# EAGLE design Node (EAGLE 9.6.2)
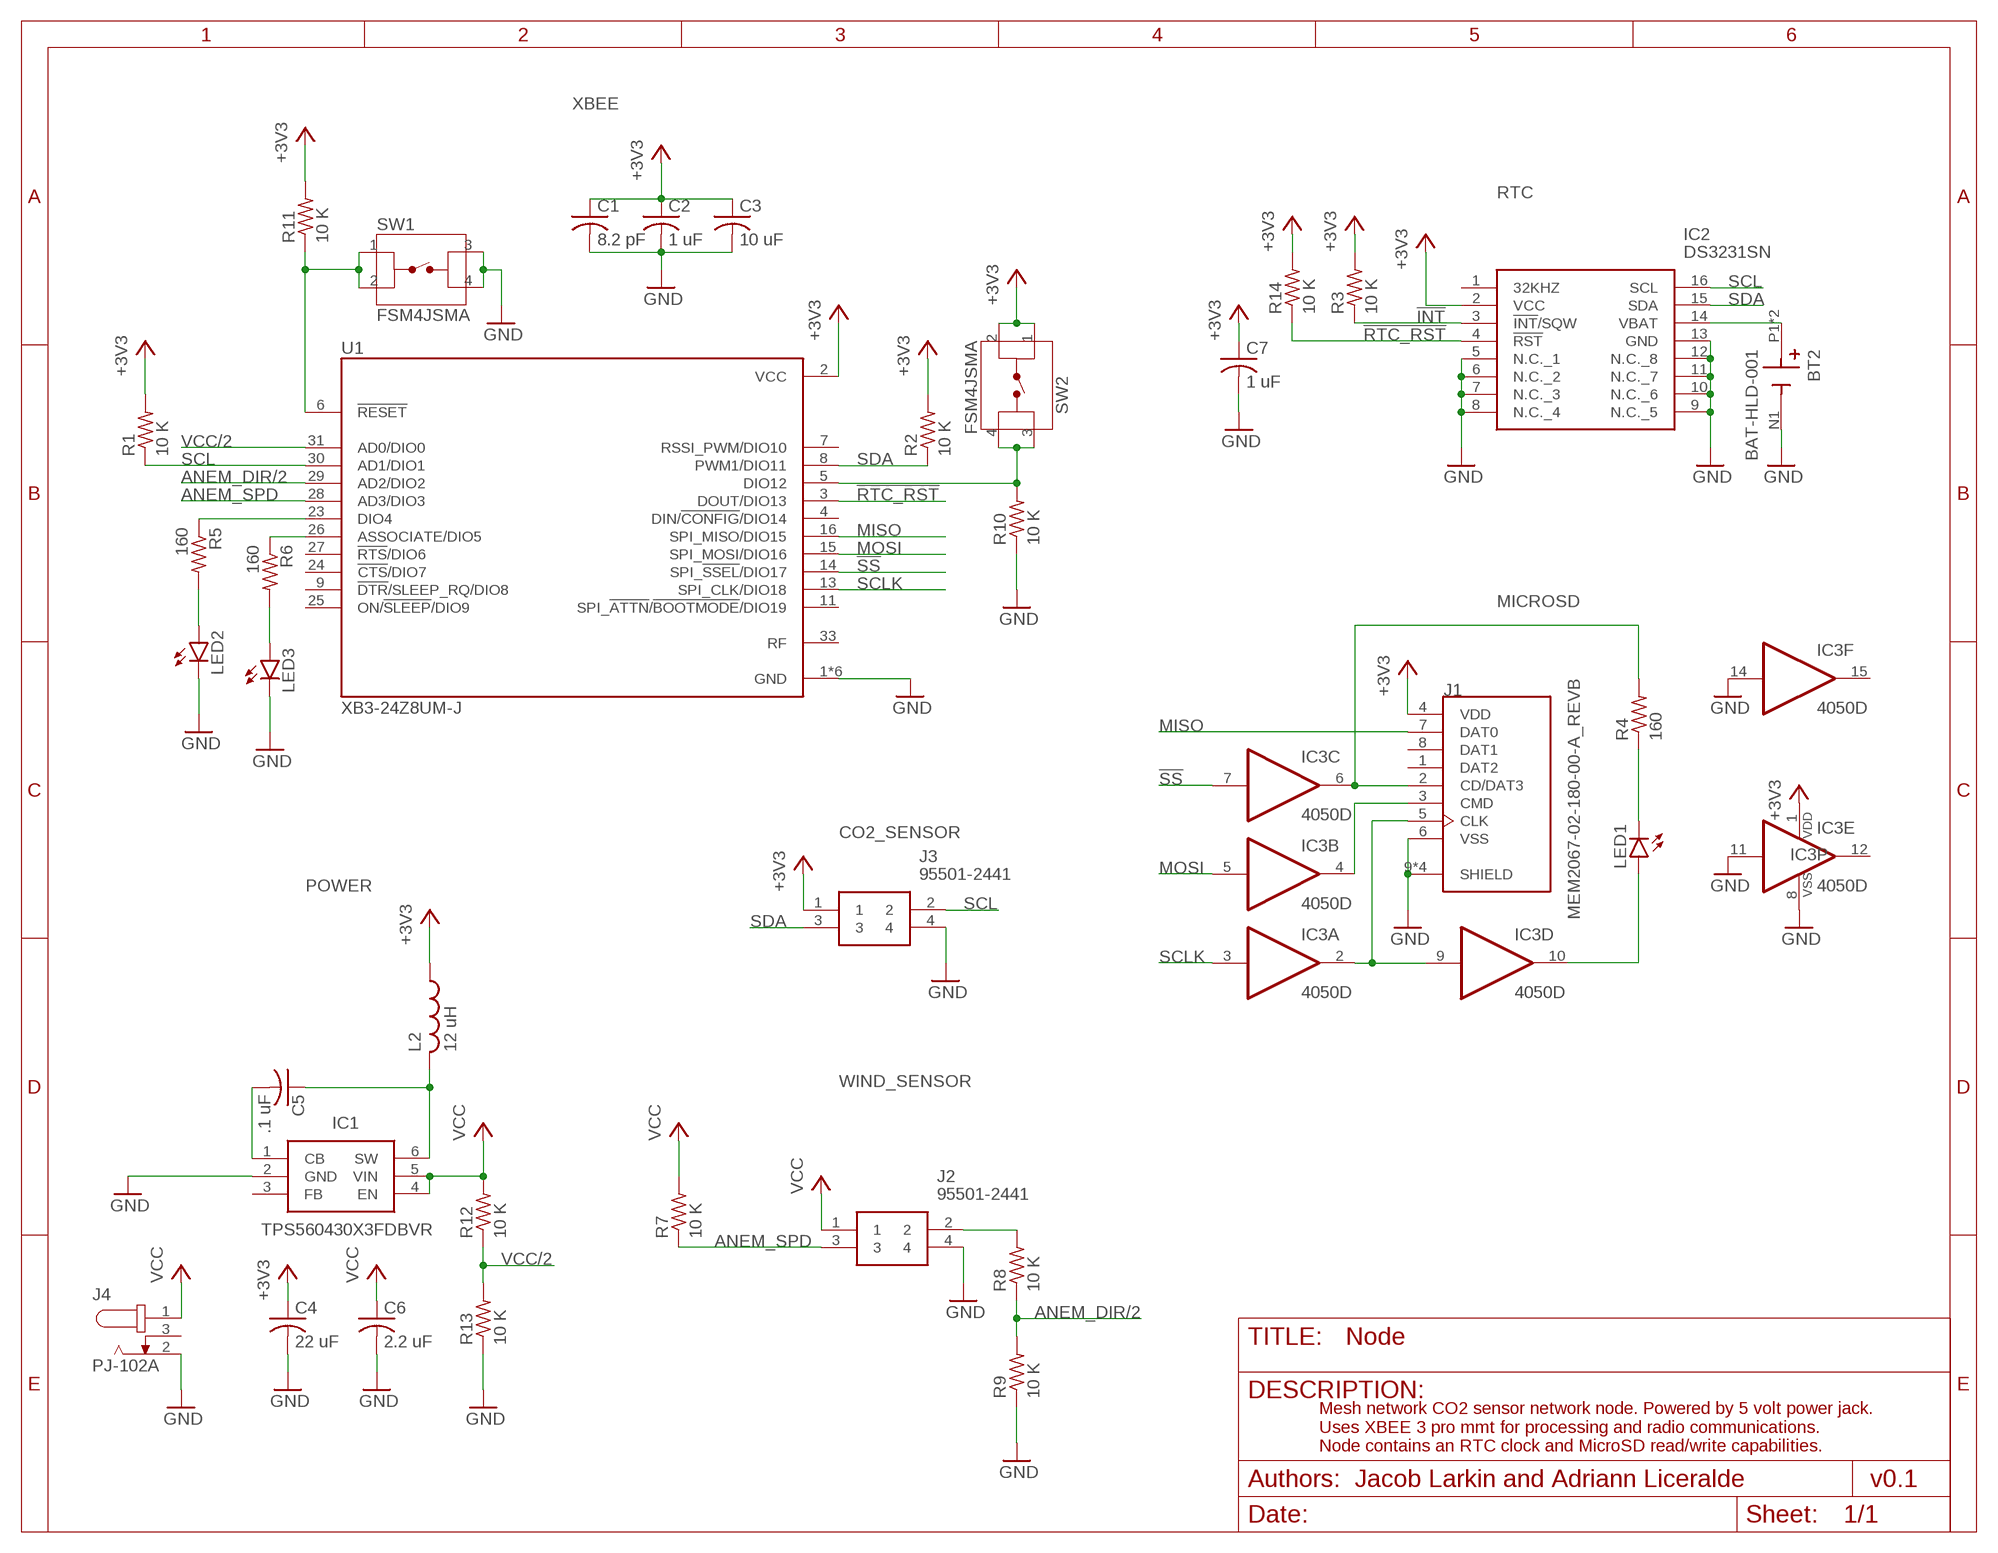
[diagram p0: schematic, sheet 1]

## Parts
BT2  BAT-HLD-001  [BAT_BAT-HLD-001]
C1  8.2 pF  C-USC0805  [C0805]
C2  1 uF  C-USC0805  [C0805]
C3  10 uF  C-USC0805  [C0805]
C4  22 uF  C-USC0805  [C0805]
C5  .1 uF  C-USC0805  [C0805]
C6  2.2 uF  C-USC0805  [C0805]
C7  1 uF  C-USC0805  [C0805]
IC1  TPS560430X3FDBVR  [SOT95P280X145-6N]
IC2  DS3231SN  [SOIC127P1032X265-16N]
IC3  4050D  [SO16]
J1  MEM2067-02-180-00-A_REVB  [GCT_MEM2067-02-180-00-A_REVB]
J2  95501-2441  [955012441]
J3  95501-2441  [955012441]
J4  PJ-102A  [CUI_PJ-102A]
L2  12 uH  L-USL1812  [L1812]
LED1  LEDCHIP-LED0805  [CHIP-LED0805]
LED2  LEDCHIP-LED0805  [CHIP-LED0805]
LED3  LEDCHIP-LED0805  [CHIP-LED0805]
R1  10 K  R-US_R0805  [R0805]
R2  10 K  R-US_R0805  [R0805]
R3  10 K  R-US_R0805  [R0805]
R4  160  R-US_R0805  [R0805]
R5  160  R-US_R0805  [R0805]
R6  160  R-US_R0805  [R0805]
R7  10 K  R-US_R0805  [R0805]
R8  10 K  R-US_R0805  [R0805]
R9  10 K  R-US_R0805  [R0805]
R10  10 K  R-US_R0805  [R0805]
R11  10 K  R-US_R0805  [R0805]
R12  10 K  R-US_R0805  [R0805]
R13  10 K  R-US_R0805  [R0805]
R14  10 K  R-US_R0805  [R0805]
SW1  FSM4JSMA  [FSM4JSMA]
SW2  FSM4JSMA  [FSM4JSMA]
U1  XB3-24Z8UM-J  [XCVR_XB3-24Z8UM-J]

## Nets
!INT: IC2.3(!INT!/SQW) R3.1
!RTC_RST: IC2.4(!RST) R14.1 U1.3(DOUT/DIO13)
!SS: IC3.7(C:I) U1.14(SPI_!SSEL!/DIO17)
+3V3: C1.1 C2.1 C3.1 C4.1 C7.1 IC2.2(VCC) IC3.1(P:VDD) J1.4(VDD) J3.1 L2.1 R1.2 R2.2 R3.2 R11.2 R14.2 SW2.1 SW2.2 U1.2(VCC)
ANEM_DIR: J2.2 R8.2
ANEM_DIR/2: R8.1 R9.2 U1.29(AD2/DIO2)
ANEM_SPD: J2.3 R7.1 U1.28(AD3/DIO3)
GND: BT2.N1(-) C1.2 C2.2 C3.2 C4.2 C6.2 C7.2 IC1.2(GND) IC2.5(N.C._1) IC2.6(N.C._2) IC2.7(N.C._3) IC2.8(N.C._4) IC2.9(N.C._5) IC2.10(N.C._6) IC2.11(N.C._7) IC2.12(N.C._8) IC2.13(GND) IC3.8(P:VSS) IC3.11(E:I) IC3.14(F:I) J1.6(VSS) J1.9(SHIELD) J1.10(SHIELD) J1.11(SHIELD) J1.12(SHIELD) J2.4 J3.4 J4.2 LED2.C LED3.C R9.1 R10.1 R13.1 SW1.3 SW1.4 U1.1(GND) U1.10(GND) U1.12(GND) U1.21(GND) U1.32(GND) U1.34(GND)
MISO: J1.7(DAT0) U1.16(SPI_MISO/DIO15)
MOSI: IC3.5(B:I) U1.15(SPI_MOSI/DIO16)
N$1: LED2.A R5.2
N$2: IC3.4(B:O) J1.3(CMD)
N$3: C5.2 IC1.1(CB)
N$4: BT2.P1(+) BT2.P2(+) IC2.14(VBAT)
N$5: C5.1 IC1.6(SW) L2.2
N$6: IC3.6(C:O) J1.2(CD/DAT3) R4.2
N$8: LED3.A R6.2
N$9: IC3.10(D:O) LED1.A
N$10: LED1.C R4.1
N$11: IC3.2(A:O) IC3.9(D:I) J1.5(CLK)
N$12: R5.1 U1.23(DIO4)
N$13: R6.1 U1.26(ASSOCIATE/DIO5)
N$14: R11.1 SW1.1 SW1.2 U1.6(!RESET)
N$16: R10.2 SW2.3 SW2.4 U1.5(DIO12)
SCL: IC2.16(SCL) J3.2 R1.1 U1.30(AD1/DIO1)
SCLK: IC3.3(A:I) U1.13(SPI_CLK/DIO18)
SDA: IC2.15(SDA) J3.3 R2.1 U1.8(PWM1/DIO11)
VCC: C6.1 IC1.4(EN) IC1.5(VIN) J2.1 J4.1 R7.2 R12.2
VCC/2: R12.1 R13.2 U1.31(AD0/DIO0)
Unconnected: IC1.3(FB) IC2.1(32KHZ) IC3.12(E:O) IC3.15(F:O) J1.1(DAT2) J1.8(DAT1) J4.3 U1.4(DIN/!CONFIG!/DIO14) U1.7(RSSI_PWM/DIO10) U1.9(!DTR!/SLEEP_RQ/DIO8) U1.11(SPI_!ATTN!/!BOOTMODE!/DIO19) U1.24(!CTS!/DIO7) U1.25(ON/!SLEEP!/DIO9) U1.27(!RTS!/DIO6) U1.33(RF)

## Notes on the sheet
- XBEE
- RTC
- MICROSD
- CO2_SENSOR
- POWER
- WIND_SENSOR
- Mesh network CO2 sensor network node. Powered by 5 volt power jack.
  Uses XBEE 3 pro mmt for processing and radio communications.
  Node contains an RTC clock and MicroSD read/write capabilities.
- Jacob Larkin and Adriann Liceralde | v0.1

## Library data of the parts
BT2 = BAT-HLD-001:BAT-HLD-001: Battery Retainer Coin, 20.0mm 1 Cell SMD (SMT) Tab Check prices <https://pricing.snapeda.com/parts/BAT-HLD-001/Linx%20Technologies/view-part?ref=eda>; AVAILABILITY: Warning; DATASHEET: https://www.mouser.com/datasheet/2/238/bat_hld_001-1659379.pdf; DESCRIPTION: Holder for CR2032 and CR2025 Batteries, Surface-Mount, Bulk Packaging; MF: Linx Technologies; MOUSER_NUM: 712-BAT-HLD-001; MP: BAT-HLD-001; PACKAGE: NON-STANDARD-1 Linx Technologies; PRICE: .29; PRICE_25: .266; PURCHASE-URL: https://pricing.snapeda.com/search/part/BAT-HLD-001/?ref=eda
C1 = rcl:C-US: CAPACITOR, American symbol; DATASHEET: https://www.mouser.com/datasheet/2/427/vjw1bcbascomseries-1762447.pdf; MOUSER_NUM: 77-VJ0805A8R2BXXPBC; PRICE: .14; PRICE_50: .1; SPICEPREFIX: C
C2 C7 = rcl:C-US: CAPACITOR, American symbol; DATASHEET: https://www.mouser.com/datasheet/2/585/MLCC-1837944.pdf; MOUSER_NUM: 187-CL21B105KBFNNNG; PRICE: .11; PRICE_100: .04; SPICEPREFIX: C
C3 = rcl:C-US: CAPACITOR, American symbol; DATASHEET: https://www.mouser.com/datasheet/2/585/MLCC-1837944.pdf; MOUSER_NUM: 187-CL21A106KOQNNNG; PRICE: .1; PRICE_10: .044; SPICEPREFIX: C
C4 = rcl:C-US: CAPACITOR, American symbol; DATASHEET: https://www.mouser.com/datasheet/2/585/MLCC-1837944.pdf; MOUSER_NUM: 187-CL21A226MPQNNNE; PRICE: .18; PRICE_100: .064; SPICEPREFIX: C
C5 = rcl:C-US: CAPACITOR, American symbol; DATASHEET: https://www.mouser.com/datasheet/2/585/MLCC-1837944.pdf; MOUSER_NUM: 187-CL21B104KBCNNNC; PRICE: .1; PRICE_10: .027; SPICEPREFIX: C
C6 = rcl:C-US: CAPACITOR, American symbol; DATASHEET: https://www.mouser.com/datasheet/2/585/MLCC-1837944.pdf; MOUSER_NUM: 187-CL21A225KAFNNNE; PRICE: .1; PRICE_10: .053; SPICEPREFIX: C
IC1 = SamacSys_Parts:TPS560430X3FDBVR: SIMPLE SWITCHER 36-V, 600-mA Buck Regulator With High-Efficiency Sleep Mode Source: Datasheet <http://www.ti.com/lit/gpn/tps560430>; DATASHEET: https://www.ti.com/lit/ds/symlink/tps560430.pdf?HQS=dis-mous-null-mousermode-dsf-pf-null-wwe&DCM=yes&ref_url=https%3A%2F%2Fwww.mouser.com%2F&distId=26; DESCRIPTION: SIMPLE SWITCHER 36-V, 600-mA Buck Regulator With High-Efficiency Sleep Mode; HEIGHT: 1.45mm; MANUFACTURER_NAME: Texas Instruments; MANUFACTURER_PART_NUMBER: TPS560430X3FDBVR; MOUSER_NUM: 595-TPS560430X3FDBVR; MOUSER_PART_NUMBER: 595-TPS560430X3FDBVR; MOUSER_PRICE-STOCK: https://www.mouser.co.uk/ProductDetail/Texas-Instruments/TPS560430X3FDBVR/?qs=y6ZabgHbY%252Bzg1UxrVv3WVw%3D%3D; PRICE: 1.19; PRICE_10: 1.01
IC2 = SamacSys_Parts:DS3231SN: Real Time Clock Serial Maxim DS3231SN Real Time Clock, Battery Backup, Calendar, Clock, I2C, 5.5 V, 16-Pin SOIC Source: Datasheet <https://datasheets.maximintegrated.com/en/ds/DS3231.pdf>; DATASHEET: https://www.mouser.com/datasheet/2/256/DS3231-1513891.pdf; DESCRIPTION: Real Time Clock Serial Maxim DS3231SN Real Time Clock, Battery Backup, Calendar, Clock, I2C, 5.5 V, 16-Pin SOIC; HEIGHT: 2.65mm; MANUFACTURER_NAME: Maxim Integrated; MANUFACTURER_PART_NUMBER: DS3231SN; MOUSER_NUM: 700-DS3231SN#T&R-; MOUSER_PART_NUMBER: 700-DS3231SN; MOUSER_PRICE-STOCK: https://www.mouser.co.uk/ProductDetail/Maxim-Integrated/DS3231SN/?qs=1eQvB6Dk1vhUlr8%2FOrV0Fw%3D%3D; PRICE: 8.82; PRICE_50: 7.37
IC3 = 40xx:4050: Hex non-inverting BUFFER; DATASHEET: https://www.mouser.com/datasheet/2/916/74HC4050-1598370.pdf; MOUSER_NUM: 771-74HC4050D-T; PRICE: .51; PRICE_100: 25.70
J1 = MEM2067-02-180-00-A_REVB:MEM2067-02-180-00-A_REVB: Micro SD Memory Card ConnectorSMT, Hinged, 1.80mm Profile Check prices <https://pricing.snapeda.com/parts/MEM2067-02-180-00-A/Global%20Connector%20Technology/view-part?ref=eda>; AVAILABILITY: Warning; DATASHEET: https://gct.co/files/specs/mem2067-spec.pdf; DESCRIPTION: 8 Position Card Connector microSD Surface Mount, Right Angle Gold; DIGI-KEY_NUM: 2073-MEM2067-02-180-00-ATR-ND; MF: Global Connector Technology; MP: MEM2067-02-180-00-A; PACKAGE: None; PRICE: 1.08; PRICE_50: .85; PURCHASE-URL: https://pricing.snapeda.com/search/part/MEM2067-02-180-00-A/?ref=eda
J2 J3 = SamacSys_Parts:95501-2441: 4/4 way r/a PCB thru hole data skt,1.5A Molex Cat3 4P4C Right Angle Cable Mount Unshielded RJ22 Modular Plug Connector Source: Datasheet <http://www.molex.com/webdocs/datasheets/pdf/en-us/0955012441_MODULAR_JACKS_PLUG.pdf>; DATASHEET: https://www.mouser.com/datasheet/2/276/1/0955012441_MODULAR_JACKS_PLUG-177497.pdf; DESCRIPTION: 4/4 way r/a PCB thru hole data skt,1.5A Molex Cat3 4P4C Right Angle Cable Mount Unshielded RJ22 Modular Plug Connector; HEIGHT: 11.5mm; MANUFACTURER_NAME: Molex; MANUFACTURER_PART_NUMBER: 95501-2441; MOUSER_NUM: 538-95501-2441; MOUSER_PART_NUMBER: 538-95501-2441; MOUSER_PRICE-STOCK: https://www.mouser.co.uk/ProductDetail/Molex/95501-2441/?qs=KUIzHt%2Fe91n%2F9dmgv%2FFrWA%3D%3D; PRICE: .86; PRICE_100: .57
J4 = PJ-102A:PJ-102A: 2.0 mm Center Pin, 2.5 A, Right Angle, Through Hole, Tapered Pins, Dc Power Jack Connector Check prices <https://pricing.snapeda.com/parts/PJ-102A/CUI%20Devices/view-part?ref=eda>; AVAILABILITY: Good; CUI_PURCHASE_URL: https://www.cuidevices.com/product/interconnect/connectors/dc-power-connectors/jacks/pj-102a?utm_source=snapeda.com&utm_medium=referral&utm_campaign=snapedaBOM; DATASHEET: https://www.mouser.com/datasheet/2/670/pj_102a-1778834.pdf; DESCRIPTION: 2.0 x 6.5 mm, 2.5 A, Horizontal, Through Hole, Tapered Pins, Dc Power Jack Connector; MF: CUI Devices; MOUSER_NUM: 490-PJ-102A; MP: PJ-102A; PACKAGE: None; PRICE: .64; PRICE_10: .479; PURCHASE-URL: https://pricing.snapeda.com/search/part/PJ-102A/?ref=eda
L2 = rcl:L-US: INDUCTOR, American symbol; DATASHEET: https://www.mouser.com/datasheet/2/54/cm-777730.pdf; MOUSER_NUM: 652-CM453232-120KL; PRICE: .27; PRICE_50: .182; SPICEPREFIX: L
LED1-LED3 = led:LED: LED OSRAM: - CHIPLED LG R971, LG N971, LY N971, LG Q971, LY Q971, LO R971, LY R971 LH N974, LH R974 LS Q976, LO Q976, LY Q976 LO Q996 - Hyper CHIPLED LW Q18S LB Q993, LB Q99A, LB R99A - SideLED LS A670, LO A670, LY A670, LG A670, LP A670 LB A673, LV A673, LT A673, LW A673 LH A674 LY A675 LS A676, LA A676, LO A676, LY A676, LW A676 LS A679, LY A679, LG A679 - Hyper Micro SIDELED® LS Y876, LA Y876, LO Y876, LY Y876 LT Y87S - SmartLED LW L88C, LW L88S LB L89C, LB L89S, LG L890 LS L89K, LO L89K, LY L89K LS L896, LA L896, LO L896, LY L896 - TOPLED LS T670, LO T670, LY T670, LG T670, LP T670 LSG T670, LSP T670, LSY T670, LOP T670, LYG T670 LG T671, LOG T671, LSG T671 LB T673, LV T673, LT T673, LW T673 LH T674 LS T676, LA T676, LO T676, LY T676, LB T676, LH T676, LSB T676, LW T676 LB T67C, LV T67C, LT T67C, LS T67K, LO T67K, LY T67K, LW E67C LS E67B, LA E67B, LO E67B, LY E67B, LB E67C, LV E67C, LT E67C LW T67C LS T679, LY T679, LG T679 LS T770, LO T770, LY T770, LG T770, LP T770 LB T773, LV T773, LT T773, LW T773 LH T774 LS E675, LA E675, LY E675, LS T675 LS T776, LA T776, LO T776, LY T776, LB T776 LHGB T686 LT T68C, LB T68C - Hyper Mini TOPLED® LB M676 - Mini TOPLED Santana® LG M470 LS M47K, LO M47K, LY M47K Source: http://www.osram.convergy.de LUXEON: - LUMILED® LXK2-PW12-R00, LXK2-PW12-S00, LXK2-PW14-U00, LXK2-PW14-V00 LXK2-PM12-R00, LXK2-PM12-S00, LXK2-PM14-U00 LXK2-PE12-Q00, LXK2-PE12-R00, LXK2-PE12-S00, LXK2-PE14-T00, LXK2-PE14-U00 LXK2-PB12-K00, LXK2-PB12-L00, LXK2-PB12-M00, LXK2-PB14-N00, LXK2-PB14-P00, LXK2-PB14-Q00 LXK2-PR12-L00, LXK2-PR12-M00, LXK2-PR14-Q00, LXK2-PR14-R00 LXK2-PD12-Q00, LXK2-PD12-R00, LXK2-PD12-S00 LXK2-PH12-R00, LXK2-PH12-S00 LXK2-PL12-P00, LXK2-PL12-Q00, LXK2-PL12-R00 Source: www.luxeon.com KINGBRIGHT: KA-3528ASYC Source: www.kingbright.com; DATASHEET: https://dammedia.osram.info/media/resource/hires/osram-dam-14795755/LG%20R971_EN.pdf; MOUSER_NUM: 720-LGR971-KN-1; PRICE: .25; PRICE_100: .058
R1-R3 R7-R14 = rcl:R-US_: RESISTOR, American symbol; DATASHEET: https://www.mouser.com/datasheet/2/219/RK73H-1825326.pdf; MOUSER_NUM: 660-RK73H2ATTD1002F; PRICE: .1; PRICE_1000: .006; SPICEPREFIX: R
R4-R6 = rcl:R-US_: RESISTOR, American symbol; DATASHEET: https://www.mouser.com/datasheet/2/219/RK73H-1825326.pdf; MOUSER_NUM: 660-RK73H2ATTD1600F; PRICE: .1; PRICE_100: .014; SPICEPREFIX: R
SW1 SW2 = Switch:FSM4JSMA: SWITCH TACTILE SPST-NO 0.05A 24V Manufacturer's datasheet <https://www.te.com/commerce/DocumentDelivery/DDEController?Action=srchrtrv&DocNm=2-1437565-7&DocType=Customer+Drawing&DocLang=English>; CREATED_BY: PCBLayout.com; DATASHEET: https://www.mouser.com/datasheet/2/418/1/NG_CD_2-1437565-7_V-202667.pdf; DIGIKEY_PART_NUMBER: 450-1129-ND; MANUFACTURER: TE Connectivity ALCOSWITCH Switches; MOUSER_NUM: 506-FSM4JSMA; MPN: FSM4JSMA; PRICE: .24; PRICE_100: .197
U1 = XB3-24Z8UM-J:XB3-24Z8UM-J: XBee3, 2.4 GHz ZB 3.0, U.FL Ant, MMT Check prices <https://pricing.snapeda.com/parts/XB3-24Z8UM-J/Digi%20International/view-part?ref=eda>; AVAILABILITY: Good; DATASHEET: https://www.mouser.com/datasheet/2/111/ds_xbee-3-zigbee-3-1288823.pdf; DESCRIPTION: 802.15.4 Zigbee® Transceiver Module 2.4GHz Antenna Not Included, U.FL Surface Mount; MF: Digi International; MOUSER_NUM: 888-XB3-24Z8UM; MP: XB3-24Z8UM-J; PACKAGE: SMD-34 Digi International; PRICE: 18.99; PURCHASE-URL: https://pricing.snapeda.com/search/part/XB3-24Z8UM-J/?ref=eda

## Board
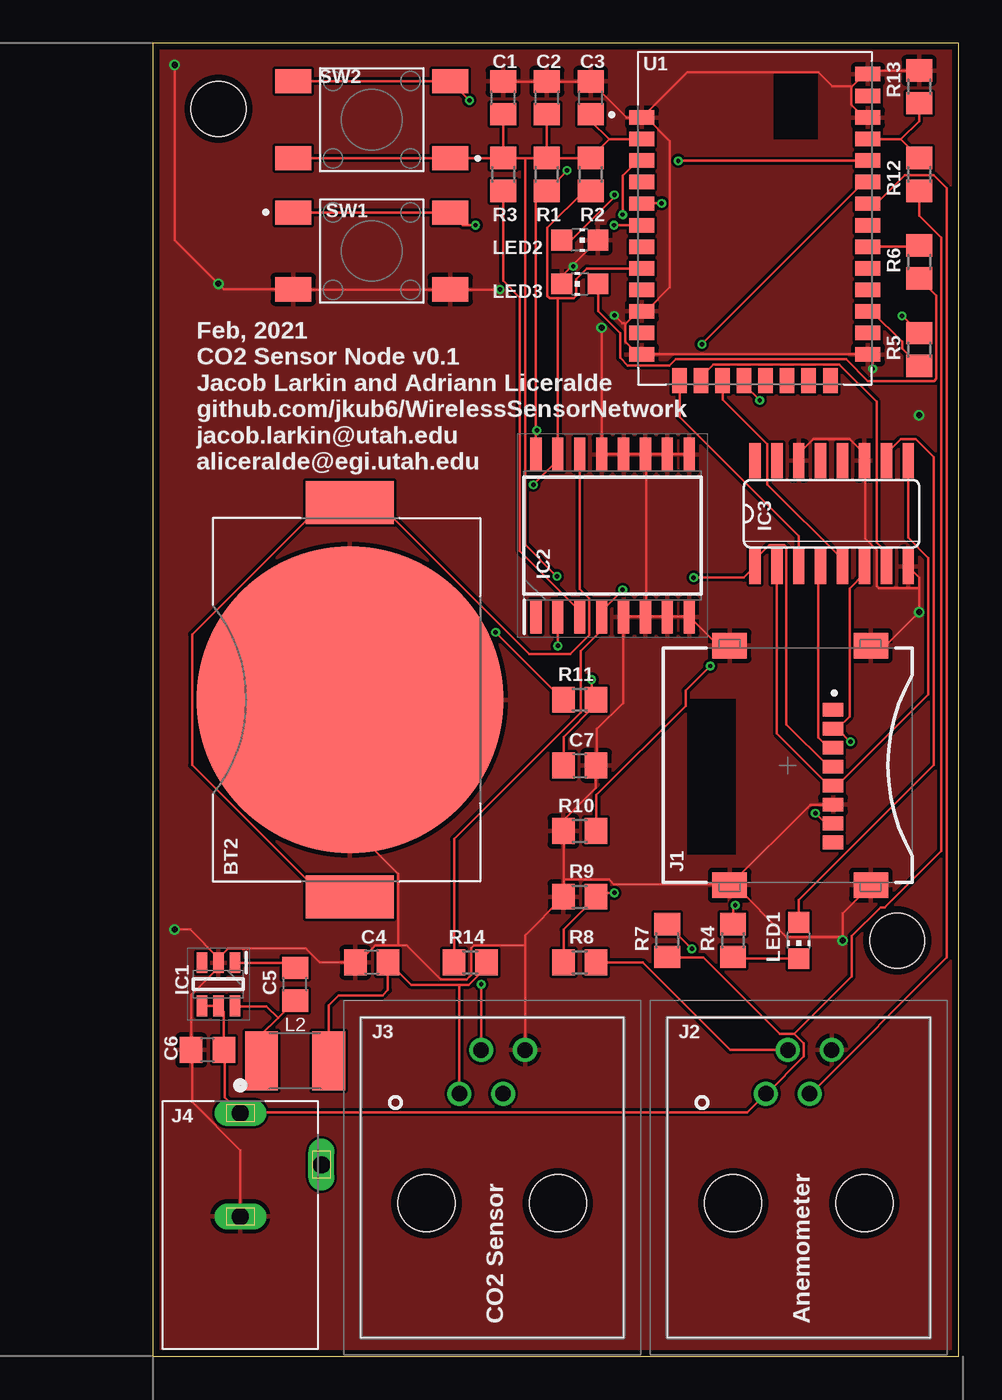
[diagram p1: board, top side]
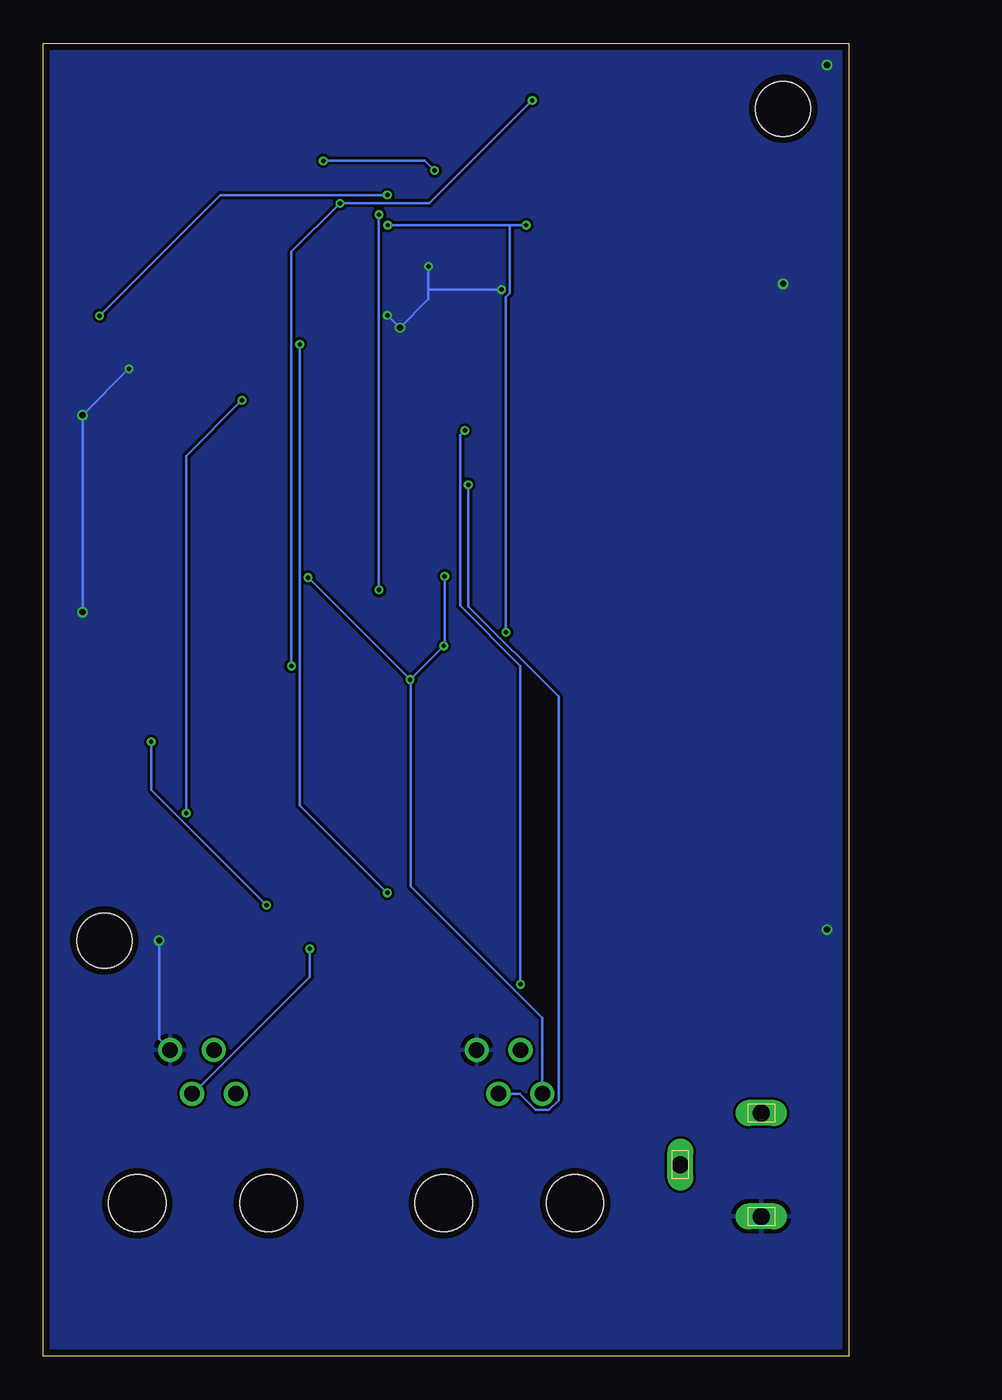
[diagram p2: board, bottom side, seen from below]

Size 46.74 x 76.2 mm. Coordinates in mm from the lower left corner, seen from the top.
Outline: 0,0 46.74,0 46.74,76.2 0,76.2 0,0
Copper layers (1*16): Top 0.035559375mm / dielectric 1.6mm / Bottom 0.035559375mm
Design rules "oshpark 2layer": minimum track width 6mil, minimum drill 10mil, track to track 6mil, track to pad 6mil, pad to pad 6mil, via to via 6mil, smd to smd 6mil, copper to edge 15mil, drill to drill 6mil, minimum pad ring 5mil, minimum via ring 5mil, stop-mask expansion 2.5mil, vias tented up to drill 0mil, thermal gap 10mil
Holes 3.17 mm at 3.81,72.39 43.18,24.13

### Footprints (pad centres in the part's own frame; a part is rotated, then mirrored left to right if it is on the bottom)
BAT_BAT-HLD-001 = smd 17.8 x 17.8: N1 0,0 | smd 2.5 x 5.1: P1 -11.45,0; P2 11.45,0
C0805 = smd 1.3 x 1.5: 1 -0.95,0; 2 0.95,0
SOT95P280X145-6N = smd 1.2 x 0.6: 1 -1.25,0.95; 2 -1.25,0; 3 -1.25,-0.95; 4 1.25,-0.95; 5 1.25,0; 6 1.25,0.95
SOIC127P1032X265-16N = smd 1.925 x 0.65: 1 -4.712,4.445; 2 -4.712,3.175; 3 -4.712,1.905; 4 -4.712,0.635; 5 -4.712,-0.635; 6 -4.712,-1.905; 7 -4.712,-3.175; 8 -4.712,-4.445; 9 4.712,-4.445; 10 4.712,-3.175; 11 4.712,-1.905; 12 4.712,-0.635; 13 4.712,0.635; 14 4.712,1.905; 15 4.712,3.175; 16 4.712,4.445
SO16 = smd 0.66 x 2.032: 1 -4.445,-3.073; 2 -3.175,-3.073; 3 -1.905,-3.073; 4 -0.635,-3.073; 5 0.635,-3.073; 6 1.905,-3.073; 7 3.175,-3.073; 8 4.445,-3.073; 9 4.445,3.073; 10 3.175,3.073; 11 1.905,3.073; 12 0.635,3.073; 13 -0.635,3.073; 14 -1.905,3.073; 15 -3.175,3.073; 16 -4.445,3.073
GCT_MEM2067-02-180-00-A_REVB = smd 0.8 x 1.2: 1 3.225,-2.625; 2 2.125,-2.625; 3 1.025,-2.625; 4 -0.075,-2.625; 5 -1.175,-2.625; 6 -2.275,-2.625; 7 -3.375,-2.625; 8 -4.475,-2.625 | smd 1.5 x 2: 9 -6.945,-4.825; 10 -6.945,3.375; 11 6.945,3.375; 12 6.945,-4.825
955012441 = drill 0.9 pad 1.4: 1 0,0; 2 1.27,2.54; 3 2.54,0; 4 3.81,2.54 | hole 3.3: -1.905,-6.35; 5.715,-6.35
CUI_PJ-102A = drill 1 long: 1 -6.5,0; 2 -0.5,0; 3 -3.5,4.7
L1812 = smd 1.9 x 3.4: 1 -1.95,0; 2 1.95,0
CHIP-LED0805 = smd 1.2 x 1.2: A 0,-1.05; C 0,1.05
R0805 = smd 1.3 x 1.5: 1 -0.95,0; 2 0.95,0
FSM4JSMA = smd 1.4 x 2.1: 1 2.23,4.55; 2 2.23,-4.55; 3 -2.23,4.55; 4 -2.23,-4.55
XCVR_XB3-24Z8UM-J = smd 1.448 x 0.838: 1 -6.553,5.842; 2 -6.553,4.592; 3 -6.553,3.343; 4 -6.553,2.093; 5 -6.553,0.843; 6 -6.553,-0.406; 7 -6.553,-1.656; 8 -6.553,-2.906; 9 -6.553,-4.155; 10 -6.553,-5.405; 11 -6.553,-6.655; 12 -6.553,-7.904; 21 6.553,-7.904; 22 6.553,-6.655; 23 6.553,-5.405; 24 6.553,-4.155; 25 6.553,-2.906; 26 6.553,-1.656; 27 6.553,-0.406; 28 6.553,0.843; 29 6.553,2.093; 30 6.553,3.343; 31 6.553,4.592; 32 6.553,5.842; 33 6.553,7.092; 34 6.553,8.357 | smd 0.838 x 1.448: 13 -4.381,-9.436; 14 -3.132,-9.436; 15 -1.882,-9.436; 16 -0.632,-9.436; 17 0.617,-9.436; 18 1.867,-9.436; 19 3.117,-9.436; 20 4.381,-9.436

### Placement (x,y rotation side)
BT2  11.43,38.1 270 top
C1  20.32,73.03 90 top
C2  22.86,73.03 90 top
C3  25.4,73.03 90 top
C4  12.7,22.86 180 top
C5  8.26,21.59 90 top
C6  3.17,17.78 180 top
C7  24.77,34.29 0 top
IC1  3.81,21.59 270 top
IC2  26.67,47.62 90 top
IC3  39.37,48.9 0 top
J1  36.83,34.29 90 top
J2  35.56,15.24 0 top
J3  17.78,15.24 0 top
J4  5.08,7.62 270 top
L2  8.26,17.14 180 top
LED1  37.47,24.13 180 top
LED2  24.77,64.77 270 top
LED3  24.77,62.23 90 top
R1  22.86,68.58 90 top
R2  25.4,68.58 90 top
R3  20.32,68.58 90 top
R4  33.66,24.13 90 top
R5  44.45,58.42 90 top
R6  44.45,63.5 270 top
R7  29.84,24.13 270 top
R8  24.77,22.86 0 top
R9  24.77,26.67 0 top
R10  24.77,30.48 0 top
R11  24.77,38.1 0 top
R12  44.45,68.58 270 top
R13  44.45,73.66 270 top
R14  18.41,22.86 0 top
SW1  12.7,64.14 90 top
SW2  12.7,71.75 270 top
U1  34.92,66.04 0 top

### Tracks (layer width: path | path; a pad name or v marks a point on that pad's centre or on a via)
!INT
  Top 0.152: R3.1 20.32,62.41 21.29,61.44 21.29,46.74 24.77,43.26 IC2.3
!RTC_RST  (via drill 0.25)
  Top 0.152: v27.25,66.24 27.25,68.5 28.12,69.37 28.37,69.37 U1.3 | v27.25,44.48 26.04,43.26 IC2.4 26.01,42.85 26.01,42.11 24.82,40.92 24.82,37.36 17.48,30.02 17.48,22.86 R14.1
  Bottom 0.152: v27.25,44.48 v27.25,66.24
!SS
  Top 0.152: IC3.7 42.55,46.66 41.99,47.22 41.99,55.4 39.83,57.56 32.51,57.56 31.8,56.84 31.8,56.62 U1.14
+3V3  (via drill 0.25)
  Top 0.152: C1.1 R3.2 | 21.59,69.52 20.37,69.52 R3.2 | 21.59,69.52 R1.2 | R1.2 C2.1 | 26.47,70.61 28.37,70.61 U1.2 | 26.47,70.61 25.4,69.55 R2.2 25.35,69.52 22.91,69.52 R1.2 | C3.1 25.4,71.68 26.47,70.61 | SW2.2 SW2.1 17.32,69.52 20.24,69.52 R3.2 | 17.78,21.57 14.99,21.57 13.72,22.84 C4.1 13.64,21.26 13.34,20.95 10.79,20.95 10.21,20.36 L2.1 | 17.78,21.57 18.34,21.57 19.36,22.58 R14.2 | 17.78,21.57 J3.1 | C7.1 23.82,35.94 25.7,37.82 R11.2 25.65,38.15 25.45,38.35 v25.45,39.27 | v23.5,41.22 IC2.2 | J1.4 39.45,34.24 39.19,34.24 36.75,36.68 36.75,46.94 36.63,47.07 35.76,47.07 34.92,46.23 IC3.1 34.29,45.19 v31.37,45.19 | 21.59,69.52 21.59,47.12 v23.44,45.26
  Bottom 0.152: v25.45,39.27 v23.5,41.22 23.44,41.27 v23.44,45.26 | v31.37,45.19 v25.45,39.27 | J3.1 17.78,19.63 25.4,27.25 25.4,39.22 v25.45,39.27
ANEM_DIR
  Top 0.152: R8.2 28.42,22.86 33.5,17.78 J2.2
ANEM_DIR/2  (via drill 0.25)
  Top 0.152: v31.85,58.73 41.25,68.12 U1.29 | v26.77,26.9 25.96,26.9 25.73,26.67 R9.2 25.68,26.62 23.82,24.77 R8.1
  Bottom 0.152: v31.85,58.73 31.85,31.98 v26.77,26.9
ANEM_SPD  (via drill 0.25)
  Top 0.152: J2.3 38.15,15.24 46.05,23.14 46.05,67.77 45.29,68.53 43.61,68.53 41.99,66.9 41.48,66.9 U1.28 | v31.27,23.65 R7.1
  Bottom 0.152: v31.27,23.65 31.27,22.02 38.05,15.24 J2.3
GND  (via drill 0.25, 0.35)
  Top 0.152: v1.27,74.93 1.27,64.77 v3.81,62.23 4.12,61.92 8.13,61.92 SW1.3 8.2,61.9 SW1.4 17.32,61.9 v20.14,61.9 | U1.32 41.25,71.88 40.51,72.62 40.51,73.64 | 40.51,73.64 41.27,74.4 U1.34 41.68,74.6 R13.1 | C1.2 20.32,73.97 22.86,73.97 C2.2 22.91,73.97 25.35,73.97 C3.2 25.4,73.97 27.48,71.88 U1.1 | U1.1 30.99,74.5 38.61,74.5 39.42,73.69 40.46,73.69 40.51,73.64 | v1.27,24.77 2.16,24.77 3.81,23.11 IC1.2 | IC1.2 3.76,22.78 3.76,22.5 2.23,20.98 2.23,17.78 C6.2 2.29,17.73 2.29,14.76 5.08,11.96 J4.2 | IC1.2 3.86,23.16 4.37,23.67 8.87,23.67 9.68,22.86 C4.2 11.81,22.89 11.94,22.89 12.9,23.85 14.22,23.85 | J1.6 39.45,32 38.12,32 33.48,27.36 J1.10 | J1.9 41.63,27.33 40.01,25.7 v40.01,24.13 39.95,24.33 36.75,24.33 33.66,27.43 J1.10 | 23.82,27.66 R10.1 23.88,30.53 23.88,31.14 25.7,32.97 C7.2 25.76,34.34 25.76,36.4 27.28,37.92 27.28,42.85 IC2.5 27.3,42.93 28.57,42.93 IC2.6 | 23.82,27.66 R9.1 23.77,26.62 21.59,24.43 21.59,23.85 | 21.59,23.85 J3.4 | IC3.14 37.47,52.38 38.3,53.21 40.44,53.21 41.27,52.38 IC3.11 41.33,51.92 41.33,47.45 41.99,46.79 41.99,44.7 42.11,44.58 44.45,44.58 | 44.45,44.58 44.45,45.19 IC3.8 | 44.45,44.58 v44.45,43.18 42.52,41.25 41.66,41.25 J1.12 | 27.41,59.89 27.41,58.88 28.14,58.14 U1.12 28.42,58.17 40.34,58.17 40.36,58.14 U1.21 41.5,58.06 41.76,57.81 v41.76,57.3 | 27.41,59.89 28.14,60.63 U1.10 28.42,60.68 28.65,60.68 30,62.03 30,70.51 28.55,71.96 U1.1 | IC2.6 28.63,42.93 29.84,42.93 IC2.7 29.9,42.93 31.11,42.93 IC2.8 31.17,42.88 32.79,41.25 33.45,41.25 J1.11 | 24.33,63.3 25.81,64.77 LED2.C | 24.33,63.3 23.72,62.69 23.72,62.23 LED3.C | v26.04,59.69 IC2.13 26.09,52.35 IC2.12 27.36,52.35 IC2.11
  Top 0.152: IC2.11 28.63,52.35 IC2.10 29.9,52.35 IC2.9 | v24.38,63.25 24.33,63.3 | IC2.6 28.63,43 28.63,52.27 IC2.11 | v26.77,60.4 27.23,59.94 27.36,59.94 27.41,59.89 | 23.82,27.66 26.47,27.66 26.75,27.38 33.4,27.38 J1.10 | 14.22,23.85 14.73,23.85 16.71,21.87 18.21,21.87 18.47,22.12 18.47,23.7 18.62,23.85 21.59,23.85 | BT2.N1 11.43,30.79 14.22,27.99 14.22,23.85
  Bottom 0.152: v40.01,24.13 40.01,18.41 J2.4 | v44.45,43.18 v44.45,54.61 v41.76,57.3 | 24.38,61.9 24.38,61.34 v26.04,59.69 26.09,59.72 v26.77,60.4 | 24.38,61.9 v24.38,63.25 | 24.38,61.9 v20.14,61.9
  pour Top: 0,76.2 46.99,76.2 46.99,0 0,0
  pour Bottom: 0,76.2 46.99,76.2 46.99,0 0,0
MISO  (via drill 0.25)
  Top 0.152: v38.43,31.52 39.01,30.94 39.45,30.94 J1.7 | v35.2,55.47 34.31,56.36 34.31,56.59 U1.16
  Bottom 0.152: v38.43,31.52 38.43,52.25 v35.2,55.47
MOSI
  Top 0.152: IC3.5 40.01,46.23 35.64,50.6 35.64,52.93 33.05,55.52 U1.15
N$1  (via drill 0.25)
  Top 0.152: LED2.A 24.28,64.77 26.77,67.26 v26.77,67.39 | v43.46,60.38 44.45,59.38 R5.2
  Bottom 0.152: v26.77,67.39 36.45,67.39 v43.46,60.38
N$2
  Top 0.152: IC3.4 38.61,45.7 38.61,35.92 39.19,35.33 39.45,35.33 J1.3
N$3
  Top 0.152: IC1.1 4.78,22.84 7.98,22.84 8.26,22.55 C5.2
N$4
  Top 0.152: IC2.14 24.77,44.53 25.32,43.97 25.32,41.86 24.21,40.74 21.84,40.74 13.06,49.53 11.43,49.53 BT2.P1 11.38,49.48 9.88,49.48 2.29,41.88 2.29,34.31 9.93,26.67 11.43,26.67 BT2.P2
N$5
  Top 0.152: 7.26,19.63 8.26,20.62 C5.1 | 7.26,19.63 6.58,20.32 4.78,20.32 IC1.6 | 7.26,19.63 6.3,18.68 L2.2
N$6  (via drill 0.25)
  Top 0.152: IC3.6 41.27,45.41 40.41,44.55 40.41,37.13 39.7,36.42 39.47,36.42 J1.2 39.75,36.37 v40.46,35.66 | R4.2 33.66,26.06 v33.78,26.19
  Bottom 0.152: v33.78,26.19 40.46,32.87 v40.46,35.66
N$8
  Top 0.152: LED3.A 25.83,62.23 25.83,60.66 27.1,59.38 27.1,57.94 27.56,57.48 29.95,57.48 30.33,57.86 40.21,57.86 41.48,56.59 45.31,56.59 45.44,56.72 45.44,61.54 44.45,62.53 R6.2
N$9
  Top 0.152: LED1.A 37.47,26.49 45.29,34.31 45.29,52.17 44.25,53.21 43.38,53.21 42.55,52.38 IC3.10
N$10
  Top 0.152: LED1.C 33.73,23.09 33.66,23.16 R4.1
N$11
  Top 0.152: IC3.2 36.2,36.14 39.22,33.12 J1.5 39.52,33.15 39.73,33.15 44.98,38.41 44.98,46.33 43.81,47.5 IC3.9
N$12
  Top 0.152: U1.23 41.71,60.63 43.46,58.88 43.46,58.47 R5.1
N$13
  Top 0.152: U1.26 44.4,64.39 R6.1
N$14  (via drill 0.25)
  Top 0.152: v26.75,65.63 U1.6 | v18.72,65.63 17.98,65.63 17.27,66.34 SW1.2 17.2,66.37 SW1.1 | v19.89,42.01 23.8,38.1 R11.1
  Bottom 0.152: v18.72,65.63 19.66,65.63 | 19.66,65.63 v26.75,65.63 | v19.89,42.01 19.89,61.47 19.66,61.7 19.66,65.63
N$16  (via drill 0.25)
  Top 0.152: v29.52,66.9 28.37,66.9 U1.5 | v18.36,72.87 17.27,73.97 SW2.3 17.2,73.99 SW2.4 | v32.33,40.06 30.91,38.63 30.91,37.74 25.73,32.56 25.73,30.48 R10.2
  Bottom 0.152: v18.36,72.87 24.33,66.9 v29.52,66.9 32.33,64.08 v32.33,40.06
SCL  (via drill 0.25)
  Top 0.152: v30.48,69.37 41.48,69.37 U1.30 | v24.03,68.81 R1.1 22.84,67.56 22.23,66.95 22.23,53.72 | 22.23,53.72 IC2.16 | v19.05,21.59 J3.2 | v22.28,53.72 22.23,53.72
  Bottom 0.152: v30.48,69.37 24.59,69.37 v24.03,68.81 | v19.05,21.59 19.05,40.06 22.55,43.56 22.55,53.44 v22.28,53.72
SCLK
  Top 0.152: IC3.3 37.47,47.6 30.56,54.51 30.56,56.59 U1.13
SDA  (via drill 0.25)
  Top 0.152: 23.5,61.39 23.01,61.39 22.89,61.52 22.89,65.48 25.02,67.61 25.4,67.61 R2.1 | 23.5,61.39 24.41,61.39 24.56,61.54 24.56,62.51 25.17,63.12 28.37,63.12 U1.8 | 23.5,61.39 IC2.15 23.47,52.27 23.47,51.97 v22.07,50.57
  Bottom 0.152: J3.3 19.1,15.24 18.16,14.3 17.4,14.3 16.84,14.86 16.84,38.28 22.07,43.51 v22.07,50.57
VCC
  Top 0.152: IC1.4 IC1.5 3.83,20.27 4.12,19.99 C6.1 4.17,17.73 4.17,15.04 J4.1 5.13,14.17 34.49,14.17 J2.1 35.61,15.24 37.77,17.4 37.77,18.16 37.21,18.72 | 37.21,18.72 36.37,18.72 31.93,23.16 29.84,23.16 R7.2 | R12.2 44.45,66.19 45.74,64.9 45.74,29.34 42.47,26.06 42.22,26.06 40.54,24.38 40.54,22.05 37.21,18.72
VCC/2
  Top 0.152: 43.38,70.61 41.48,70.61 U1.31 | 43.38,70.61 44.45,69.55 R12.1 | R13.2 44.45,71.68 43.38,70.61

### Text on the board
tPlace: Feb, 2021 / CO2 Sensor Node v0.1 / Jacob Larkin and Adriann Liceralde / github.com/jkub6/WirelessSensorNetwork / jacob.larkin@utah.edu / aliceralde@egi.utah.edu | CO2 Sensor | Anemometer